# Altium project ESP-12F_WLED_IOT_LIPO.PrjPcb
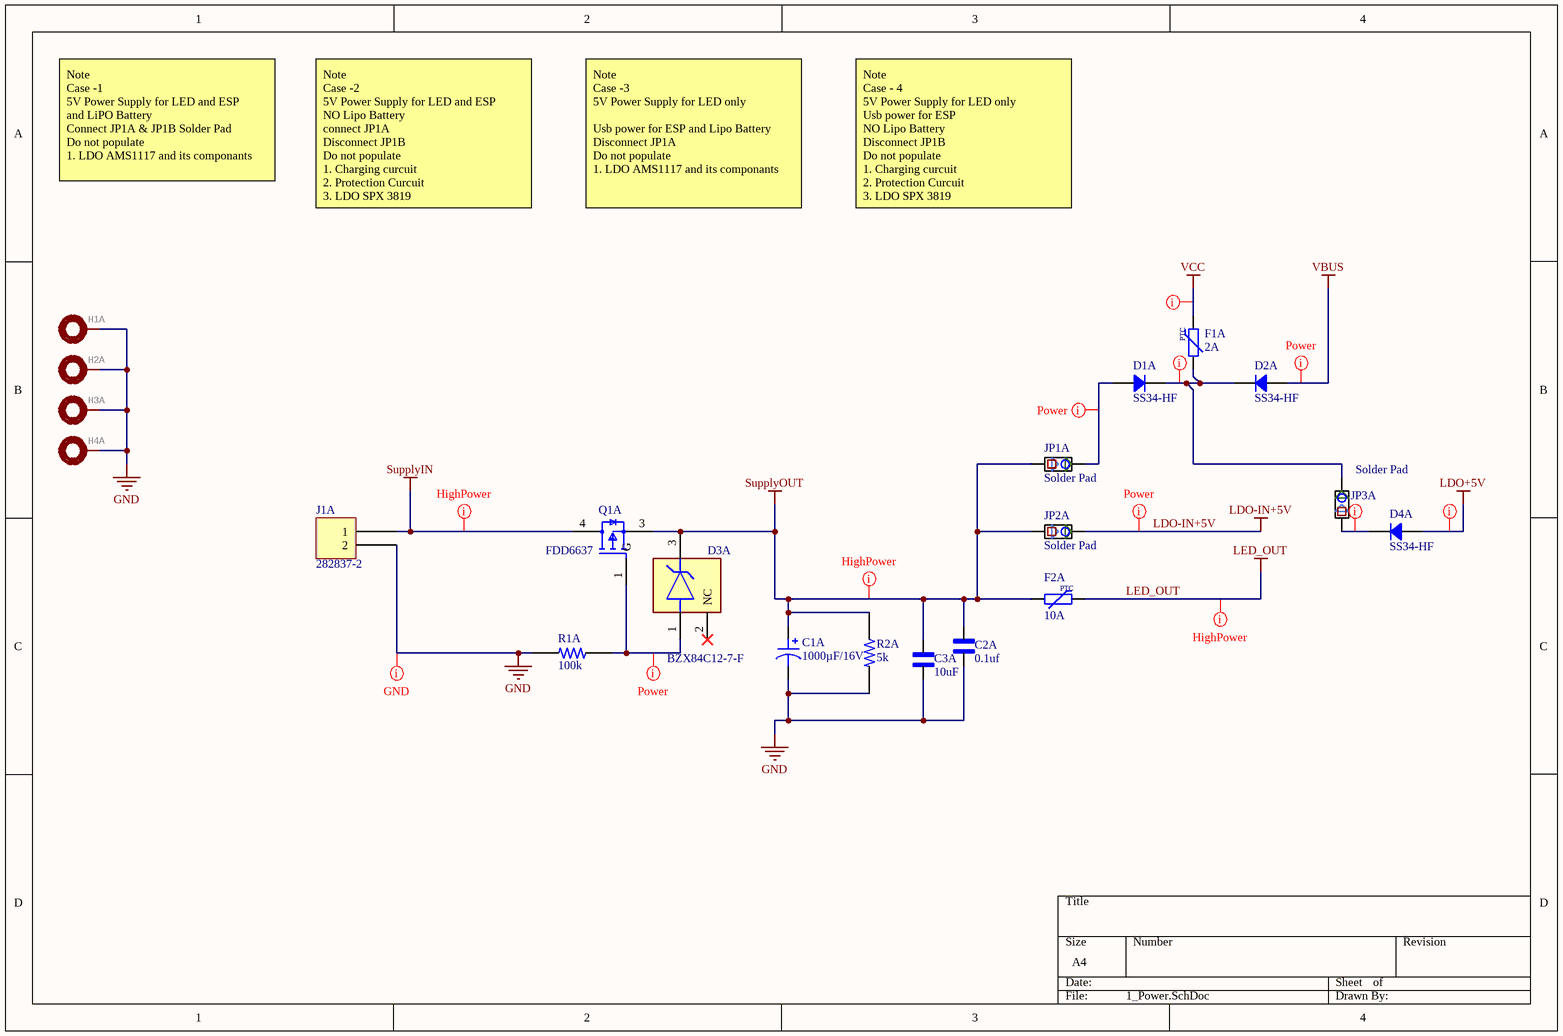
[diagram p0: 1_Power.SchDoc]
12 sheets, 111 parts. Net scope: global (net labels, ports and power ports of the same name join across sheets).
Board file: ESP-12F_WLED_IOT_LIPO_PCB_Version_2.PcbDoc
Sheets:
  0_Overview.SchDoc
  1_Power.SchDoc
  2_LDO+5V.SchDoc
  3_Charging.SchDoc
  4_Protection.SchDoc
  5_BATT+3V3.SchDoc
  6_BATT+5V.SchDoc
  5_USB-UART.SchDoc
  6_ESP12_F.SchDoc
  7_Temp.SchDoc
  8_LevelShifter.SchDoc
  9_Connectors & IO.SchDoc

## Sheet 0_Overview.SchDoc
size A4; SheetNumber: 1; SheetTotal: 5

## Sheet 1_Power.SchDoc
size A4; SheetNumber: 2; SheetTotal: 12; SPICEModelCacheZZLNYIBB: <root> / <DocumentId>ZZLNYIBB</DocumentId> / </root>

### Parts
C1A  1000µF/16V  [CAP TH ALUM ELEC D10.00mm S5.00mm H17.50mm]
C2A  0.1uf  [C-0603]
C3A  10uF  [C-0603]
D1A  SS34-HF  [DO214AC SMA]
D2A  SS34-HF  [DO214AC SMA]
D3A  BZX84C12-7-F  [FP-SOT23-MFG]
D4A  SS34-HF  [DO214AC SMA]
F1A  2A  [FUSE_1206]
F2A  10A  [FUSE_1206]
H1A  MOUNTING PAD, round  [2,4-PAD]  (value not drawn)
H2A  MOUNTING PAD, round  [2,4-PAD]  (value not drawn)
H3A  MOUNTING PAD, round  [2,4-PAD]  (value not drawn)
H4A  MOUNTING PAD, round  [2,4-PAD]  (value not drawn)
J1A  282837-2  [TE 282837-2]
JP1A  Solder Pad  [Solder_Pad_2_Pin_NC_Medium]
JP2A  Solder Pad  [Solder_Pad_2_Pin_NC_Medium]
JP3A  Solder Pad  [Solder_Pad_2_Pin_NC_Medium]
Q1A  FDD6637  [FP-369AS-MFG]
R1A  100k  [R-0603]
R2A  5k  [R-0603]

### Nets
GND: C1A.2 C2A.1 C3A.1 H1A.1(MOUNT) H2A.1(MOUNT) H3A.1(MOUNT) H4A.1(MOUNT) J1A.2 R1A.2 R2A.2
LDO+5V: D4A.1
LDO-IN+5V: JP2A.2
LED_OUT: F2A.2
SupplyIN: J1A.1 Q1A.4(D)
SupplyOUT: C1A.1 C2A.2 C3A.2 D3A.3(C) F2A.1 JP1A.1 JP2A.1 Q1A.3(S) R2A.1
VBUS: D2A.1
VCC: F1A.2
NetD1A_1: D1A.1 JP1A.2
NetD1A_2: D1A.2 D2A.2 F1A.1 JP3A.2
NetD3A_1: D3A.1(A) Q1A.1(G) R1A.1
NetD4A_2: D4A.2 JP3A.1

Not connected (* = marked no-connect by the designer): D3A 2(NC)*

### Layout directives
net class HighPower; rule Supply Nets [Voltage = 0.000]: LED_OUT, SupplyIN, SupplyOUT
net class GND; rule Supply Nets [Voltage = 0.000]: GND
net class Power: NetD1A_1
net class Power; rule Supply Nets [Voltage = 0.000]: LDO+5V, LDO-IN+5V, NetD1A_2, NetD3A_1, NetD4A_2, VBUS, VCC

### Notes on the sheet
- Note
  Case -1
  5V Power Supply for LED and ESP
  and LiPO Battery
  Connect JP1A & JP1B Solder Pad
  Do not populate
  1. LDO AMS1117 and its componants
- Note
  Case -2
  5V Power Supply for LED and ESP
  NO Lipo Battery
  connect JP1A
  Disconnect JP1B
  Do not populate
  1. Charging curcuit
  2. Protection Curcuit
  3. LDO SPX 3819
- Note
  Case -3
  5V Power Supply for LED only
  Usb power for ESP and Lipo Battery
  Disconnect JP1A
  Do not populate
  1. LDO AMS1117 and its componants
- Note
  Case - 4
  5V Power Supply for LED only
  Usb power for ESP
  NO Lipo Battery
  Disconnect JP1B
  Do not populate
  1. Charging curcuit
  2. Protection Curcuit
  3. LDO SPX 3819
- (in symbol FUSE_PPTC_1206) PTC

### Library data of the parts
C1A = EEU-FK1C102: AL LYTIC, RADIAL, 16VDC, 1000UF; manufacturer: Panasonic Electronic Components; Capacitance: 1000µF; Impedance: 49 mOhms; Lifetime @ Temp.: 4000 Hrs @ 105°C; Polarization: Polar; Ripple Current @ High Frequency: 1.24A @ 100kHz; Ripple Current @ Low Frequency: 930mA @ 120Hz; Tolerance: ±20%; Voltage - Rated: 16V; Part Number: EEU-FK1C102; Applications: Automotive; componentlink1description: Datasheet; componentlink1url: https://industrial.panasonic.com/cdbs/www-data/pdf/RDF0000/ABA0000C1015.pdf; componentlink2description: DigiKey Link; componentlink2url: http://digikey.com/product-detail/en/panasonic-electronic-components/EEU-FK1C102/P124274-ND/9921223; Device Package: Radial, Can; Height - Seated (Max): 0.689" (17.50mm); lastupdated: 02-09-2020 01:31:24 AM; Lead Spacing: 0.197" (5.00mm); Lifecycle Status: Active; Minimum Order: 1; Mounting Type: Through Hole; Operating Temperature: -55°C ~ 105°C; Package / Case: Radial, Can; packaging: Bulk; partid: 11906; Part Status: Active; price: 0.83; Ratings: AEC-Q200; series: FK; Size / Dimension: 0.394" Dia (10.00mm); Supplier 1: DigiKey; Supplier Part Number 1: P124274-ND; value: 1000µF/16V
C2A C3A = C-0603: Ceramic Capacitor 16V 0603 (1608 Metric); MP: C0603C104J4RAC; MF: KEMET; SnapEDA_Link: https://www.snapeda.com/parts/C0603C104J4RAC/KEMET/view-part/1763758/?ref=snap; Availability: Warning; Package: 0603 KEMET; Check_prices: https://www.snapeda.com/parts/C0603C104J4RAC/KEMET/view-part/1763758/?ref=eda; Value: *; Price: None
D1A D2A D4A = SS34-HF: DIODE SCHOTTKY 40V 3A DO214AC; Manufacturer: Comchip Technology; Capacitance @ Vr, F: 450pF @ 4V, 1MHz; Current - Reverse Leakage @ Vr: 500 µA @ 40 V; Speed: Fast Recovery =< 500ns, > 200mA (Io); Voltage - Forward (Vf) (Max) @ If: 550 mV @ 3 A; Part Number: SS34-HF; ComponentLink1Description: Datasheet; ComponentLink1URL: http://www.comchiptech.com/admin/files/product/20190514101641.pdf; ComponentLink2Description: DigiKey Link; ComponentLink2URL: https://www.digikey.com/en/products/detail/comchip-technology/SS34-HF/10279693; Current - Average Rectified (Io): 3A; Diode Type: Schottky; LastUpdated: 30-12-2022 08:53:12 PM; Lifecycle Status: Active; Minimum Order: 1; Mounting Type: Surface Mount; Operating Temperature - Junction: -55°C ~ 125°C; Package / Case: DO-214AC, SMA; Packaging: TapeAndReel; PartId: 2138; Part Status: Active; Price: 0.07; Series: -; Supplier 1: DigiKey; Supplier Part Number 1: 641-2115-1-ND; Supplier Device Package: DO-214AC (SMA); Voltage - DC Reverse (Vr) (Max): 40 V
D3A = CMP-12792-000017-1: DIODE ZENER 12V 300MW SOT23-3; Manufacturer: Diodes Inc.; Max Reverse Leakage Current: 0.1uA; Max Zener Voltage: 12.7V; Reverse Voltage: 8V; Zener Impedance: 25Ω; Max Junction Temp: +150°C; Standoff Height: 0.013mm; Height: 1.1mm; RoHS: TRUE; Manufacturer Part Number: BZX84C12-7-F; Digikey Description: DIODE ZENER 12V 300MW SOT23-3; Device Class L2: Diodes; Power Dissipation: 300mW; Category: Diode; Device Class L3: Zener Diodes; Footprint Url: https://www.diodes.com/assets/Package-Files/SOT23.pdf; Nom Zener Voltage: 12V; Temperature: -65°C to +150°C; ComponentLink2Description: Datasheet; Lead Free: Yes; ComponentLink2URL: https://www.diodes.com/assets/Datasheets/ds18001.pdf; Mouser Description: Zener Diodes 12V 350mW; Temperature Range Low: -65°C; Automotive: No; Package: SOT23; Ipc Land Pattern Name: SOT92P240X102-3; Temperature Range High: +150°C; Octopart: https://octopart.com/bzx84c12-7-f-diodes+inc.-327696; Device Class L1: Discrete Semiconductors
F1A F2A = FUSE_PPTC_1206: Fuse PPTC SMD 1206; Manufacturer: *; Manufacturer Part Number: *
H1A H2A H3A H4A = MOUNT-PAD-ROUND2.4: GateName_1: G$1; DeviceName: 2.8; POPULARITY: 6; SymbolName_1: MOUNT-PAD; LibraryName: Holes-Custom; DeviceSetName: MOUNT-PAD-ROUND; Package: 2,8-PAD
J1A = 282837-2: TERM BLK 2P SIDE ENT 5.08MM PCB; Manufacturer: TE Connectivity AMP Connectors; Pitch: 0.200" (5.08mm); Current: 13.5 A; Mating Orientation: Horizontal with Board; Number of Levels: 1; Positions Per Level: 2; Voltage: 300 V; Wire Gauge: 16-28 AWG; Wire Termination: Screw - Rising Cage Clamp; Packaging: Tray; Part Number: 282837-2; Color: Green; ComponentLink1Description: Datasheet; ComponentLink1URL: https://www.te.com/commerce/DocumentDelivery/DDEController?Action=srchrtrv&DocNm=282837&DocType=Customer+Drawing&DocLang=English; ComponentLink2Description: DigiKey Link; ComponentLink2URL: https://www.digikey.com/en/products/detail/te-connectivity-amp-connectors/282837-2/2187973; Features: Interlocking (Side); LastUpdated: 21-06-2022 03:00:23 PM; Lifecycle Status: Active; Minimum Order: 1; Mounting Type: Through Hole; Part Status: Active; Price: 0.31; Series: Buchanan; Supplier 1: DigiKey; Supplier Part Number 1: A113320-ND
JP1A JP2A JP3A = Solder_Pad_2_Pin_NC_Medium: Solder Pad 2 Pin NC 1.016 mm Pitch
Q1A = CMP-07173-000090-1: MOSFET P-CH 35V 13A DPAK; Manufacturer: ON Semiconductor; Threshold Vgs Max: -3V; Transconductance: 35S; Rthja Max: 96°C/W; Pulse Drain Current: -100A; Reverse Recovery Time: 28ns; Number Of P Channels: 1; Drain To Source Voltage: -35V; Turn On Delay Time: 18ns; Depletion Mode: False; Turn Off Delay Time: 62ns; Max Junction Temp: +150°C; Gate To Source Voltage: 25V; Gate Charge At Vgs: 45nC @ -10V; Threshold Vgs Min: -1V; Drain To Source Resistance: 9.7mΩ; Power Dissipation: 1.3W; Typ Forward Diode Voltage: -0.8V; Input Capacitace At Vds: 2370pF @ -20V; Max Forward Diode Voltage: -1.2V; Continuous Drain Current: -13A; Reverse Recovery Charge: 15nC; Temperature: -55°C to +150°C; Package: 369AS; Device Class L2: Transistors; Automotive: No; ComponentLink2URL: https://www.onsemi.com/pub/Collateral/FDD6637-D.pdf; Temperature Range Low: -55°C; Manufacturer Part Number: FDD6637; Number Of Channels: 1; Lead Free: Yes; Temperature Range High: +150°C; ComponentLink2Description: Datasheet; RoHS: TRUE; Octopart: https://octopart.com/fdd6637-on+semiconductor-84325825; Drain To Source Breakdown Voltage: -35V; Footprint Url: https://www.onsemi.com/pub/Collateral/369AS.PDF; Category: Trans; Device Class L1: Discrete Semiconductors; Digikey Description: MOSFET P-CH 35V 13A DPAK; Device Class L3: MOSFETs; Mouser Description: MOSFET 35V PCH PowerTrench MOSFET; Height: 2.517mm
R1A R2A = R-0603: 0603; MP: 2-1623703-0; Power_Rating: .1 W; Value: 10K; Tolerance: 1%; MF: TE Connectivity; Package: 0603; Price: None; Resistance: 10K; Check_prices: https://www.snapeda.com/parts/2-1623703-0/TE%20Connectivity/view-part/2213192/?ref=eda; SnapEDA_Link: https://www.snapeda.com/parts/2-1623703-0/TE%20Connectivity/view-part/2213192/?ref=snap; Availability: Warning

## Sheet 2_LDO+5V.SchDoc
size A4; SheetNumber: 3; SheetTotal: 12
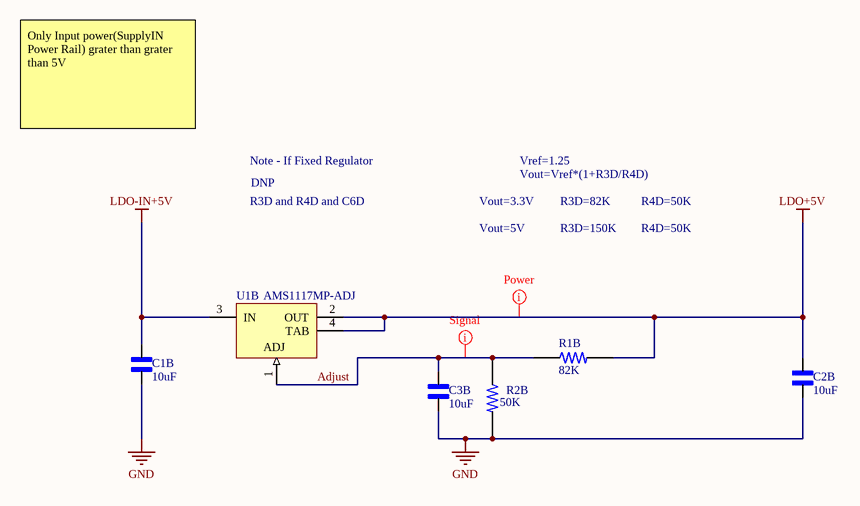
[diagram p1: 2_LDO+5V.SchDoc]

### Parts
C1B  10uF  [C-0603]
C2B  10uF  [C-0603]
C3B  10uF  [C-0603]
R1B  82K  [R-0603]
R2B  50K  [R-0603]
U1B  AMS1117MP-ADJ  [MP04A_N]

### Nets
GND: C1B.1 C2B.1 C3B.1 R2B.2
LDO+5V: C2B.2 R1B.2 U1B.2(OUT) U1B.4(TAB)
LDO-IN+5V: C1B.2 U1B.3(IN)
Adjust: C3B.2 R1B.1 R2B.1 U1B.1(ADJ)

### Layout directives
net class Power: LDO+5V
net class Signal: Adjust

### Notes on the sheet
- Only Input power(SupplyIN Power Rail) grater than grater than 5V
- Note - If Fixed Regulator
- DNP
- Vout=Vref*(1+R3D/R4D)
- Vref=1.25
- R3D and R4D and C6D
- Vout=3.3V
- Vout=5V
- R3D=82K
- R3D=150K
- R4D=50K

### Library data of the parts
C1B C2B C3B = C-0603: as C2A on sheet 1_Power; SnapEDA_Link: https://www.snapeda.com/parts/C0603C104J4RAC/KEMET/view-part/1763758/?ref=snap; Availability: Warning; Package: 0603 KEMET; Check_prices: https://www.snapeda.com/parts/C0603C104J4RAC/KEMET/view-part/1763758/?ref=eda; Price: None
  C1B C2B: Value: *
  C3B: Value: 10uF
R1B R2B = R-0603: as R1A on sheet 1_Power; Package: 0603; Price: None; Resistance: 10K; Check_prices: https://www.snapeda.com/parts/2-1623703-0/TE%20Connectivity/view-part/2213192/?ref=eda; SnapEDA_Link: https://www.snapeda.com/parts/2-1623703-0/TE%20Connectivity/view-part/2213192/?ref=snap; Availability: Warning
U1B = CMP-0062-01645-3: 800mA Low-Dropout Linear Regulator, 4-pin SOT-223; PartNumber: LM1117MP-ADJ; Manufacturer: National Semiconductor; High-Reliability: Y; PackageTopMarking: XYTT*N03A; CompType: LDO IC; PowerWise: N; ComponentLink2URL: http://www.national.com/ds/LM/LM1117.pdf; ComponentLink1Description: Manufacturer URL; DatasheetVersion: Apr-2006; PackageReference: MP04A; RoHS: N; ComponentLink3Description: LM1117 Web Page; RevisionNote: SCH symbol layout adjusted; PackageDescription: Molded SOT-223, 6.50 x 3.56 x 1.6mm Body, 4 Lead, 2.3mm Pitch; Code_IPC: SOT223-4; ComponentLink1URL: http://www.national.com/; ComponentLink4Description: MP04A Package Page; ComponentLink3URL: http://www.national.com/pf/LM/LM1117.html; PackageVersion: revB, Apr-2003; ComponentLink2Description: LM1117 Datasheet; PinCount: 4; ComponentLink4URL: http://www.national.com/packaging/folders/mp04a.html; Code_JEDEC: TO-261-AA

## Sheet 3_Charging.SchDoc
size A4; SheetNumber: 4; SheetTotal: 12
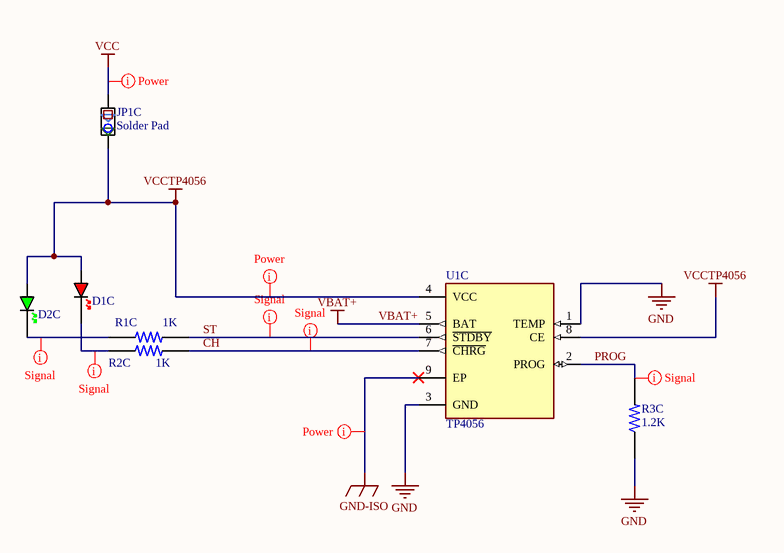
[diagram p2: 3_Charging.SchDoc]

### Parts
D1C  RED  [LED_0603_RED]  (value not drawn)
D2C  GREEN  [LED_0603_GREEN]  (value not drawn)
JP1C  Solder Pad  [Solder_Pad_2_Pin_NC_Medium]
R1C  1K  [R-0603]
R2C  1K  [R-0603]
R3C  1.2K  [R-0603]
U1C  TP4056  [TP4056]

### Nets
GND: R3C.1 U1C.1(TEMP) U1C.3(GND)
GND-ISO: U1C.9(EP)
VBAT+: U1C.5(BAT)
VCC: JP1C.1
VCCTP4056: D1C.A D2C.A JP1C.2 U1C.4(VCC) U1C.8(CE)
CH: R2C.2 U1C.7(~{CHRG})
PROG: R3C.2 U1C.2(PROG)
ST: R1C.2 U1C.6(~{STDBY})
NetD1C_K: D1C.K R2C.1
NetD2C_K: D2C.K R1C.1

### Layout directives
net class Power; rule Supply Nets [Voltage = 0.000]: GND-ISO, VCCTP4056
net class Signal: CH, NetD1C_K, NetD2C_K, PROG, ST
net class Power: VCC

### Library data of the parts
D1C = LED_0603_RED: LED 0603 RED SMD
D2C = LED_0603_GREEN: LED 0603 GREEN SMD
JP1C = Solder_Pad_2_Pin_NC_Medium: Solder Pad 2 Pin NC 1.016 mm Pitch
R1C R2C R3C = R-0603: as R1A on sheet 1_Power; Package: 0603; Price: None; Resistance: 10K; Check_prices: https://www.snapeda.com/parts/2-1623703-0/TE%20Connectivity/view-part/2213192/?ref=eda; SnapEDA_Link: https://www.snapeda.com/parts/2-1623703-0/TE%20Connectivity/view-part/2213192/?ref=snap; Availability: Warning
U1C = TP4056: Complete single cell Li-Ion battery with a constant current / constant voltage linear charger; Package: None; MP: TP4056; Value: *; Price: None; Availability: Unavailable

## Sheet 4_Protection.SchDoc
size A4; SheetNumber: 5; SheetTotal: 12
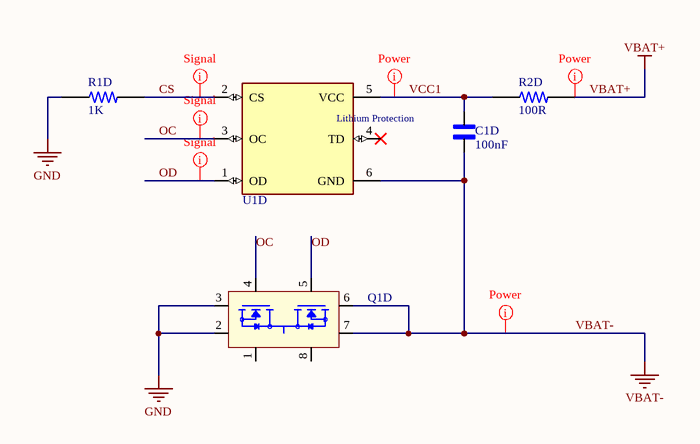
[diagram p3: 4_Protection.SchDoc]

### Parts
C1D  100nF  [C-0603]
Q1D  !value  [FS8205A TSSOP-8]  (value not drawn)
R1D  1K  [R-0603]
R2D  100R  [R-0603]
U1D  DW01A  [SOT23-6]  (value not drawn)

### Nets
GND: Q1D.2(S1) Q1D.3(S1) R1D.1
VBAT+: R2D.2
VBAT-: C1D.1 Q1D.6(S2) Q1D.7(S2) U1D.6(GND)
CS: R1D.2 U1D.2(CS)
OC: Q1D.4(G1) U1D.3(OC)
OD: Q1D.5(G2) U1D.1(OD)
VCC1: C1D.2 R2D.1 U1D.5(VCC)

Not connected (* = marked no-connect by the designer): Q1D 1(D12) 8(D12); U1D 4(TD)*

### Layout directives
net class Power; rule Supply Nets [Voltage = 0.000]: VBAT+, VBAT-, VCC1
net class Signal: CS, OC, OD

### Notes on the sheet
- (in symbol DW01A) Lithium Protection

### Library data of the parts
C1D = C-0603: as C2A on sheet 1_Power; SnapEDA_Link: https://www.snapeda.com/parts/C0603C104J4RAC/KEMET/view-part/1763758/?ref=snap; Availability: Warning; Package: 0603 KEMET; Check_prices: https://www.snapeda.com/parts/C0603C104J4RAC/KEMET/view-part/1763758/?ref=eda; Value: *; Price: None
Q1D = FS8205A_2.0: Dual N-Channel Mosfet, Eq 8205A CEG8205A FS8205A STN8205A; Availability: Unavailable; Package: None; Price: None; Value: FS8205A; MP: FS8205A
R1D R2D = R-0603: as R1A on sheet 1_Power; Package: 0603; Price: None; Resistance: 10K; Check_prices: https://www.snapeda.com/parts/2-1623703-0/TE%20Connectivity/view-part/2213192/?ref=eda; SnapEDA_Link: https://www.snapeda.com/parts/2-1623703-0/TE%20Connectivity/view-part/2213192/?ref=snap; Availability: Warning
U1D = DW01A: Pushbutton Switch SPST-NC Standard Panel Mount, Front; MF: Fortune Semiconductor; Price: None; Availability: Unavailable; Package: Package Analog Devices; SnapEDA_Link: https://www.snapeda.com/parts/DW01A/Fortune%20Semiconductor/view-part/4388554/?ref=snap; MP: DW01A; Value: *

## Sheet 5_BATT+3V3.SchDoc
size A4; SheetNumber: 6; SheetTotal: 12
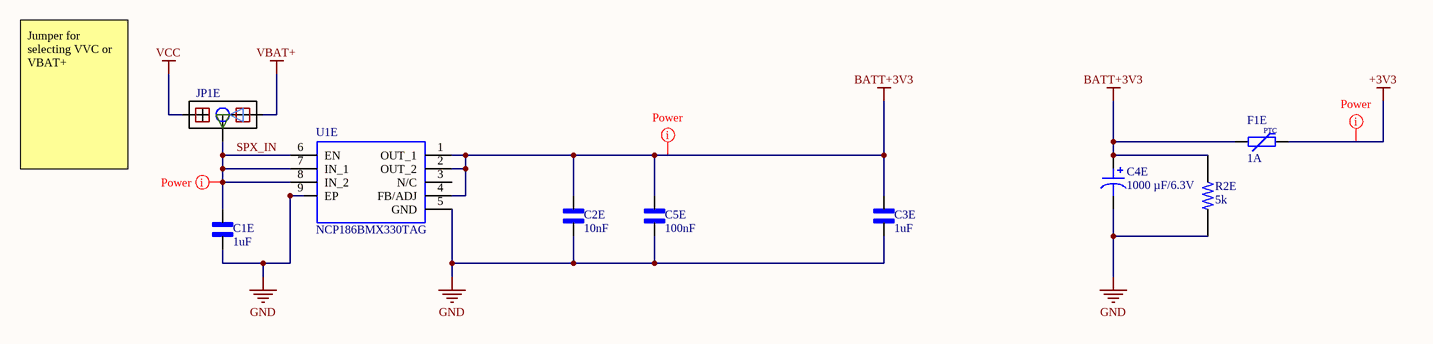
[diagram p4: 5_BATT+3V3.SchDoc]

### Parts
C1E  1uF  [C-0603]
C2E  10nF  [C-0603]
C3E  1uF  [C-0603]
C4E  1000 µF/6.3V  [CAP AL TH D8 L3.5 H12.5]
C5E  100nF  [C-0603]
F1E  1A  [FUSE_1206]
JP1E  Solder Pad  [Solder_Pad_3_Pin_NC_Medium]  (value not drawn)
R2E  5k  [R-0603]
U1E  NCP186BMX330TAG  [NCP186AMX330TAG]

### Nets
+3V3: F1E.2
BATT+3V3: C2E.2 C3E.2 C4E.1 C5E.2 F1E.1 R2E.1 U1E.1(OUT_1) U1E.2(OUT_2) U1E.4(FB/ADJ)
GND: C1E.1 C2E.1 C3E.1 C4E.2 C5E.1 R2E.2 U1E.5(GND) U1E.9(EP)
VBAT+: JP1E.1
VCC: JP1E.3
SPX_IN: C1E.2 JP1E.2 U1E.6(EN) U1E.7(IN_1) U1E.8(IN_2)

Not connected (* = marked no-connect by the designer): U1E 3(N/C)

### Layout directives
net class Power; rule Supply Nets [Voltage = 0.000]: +3V3, BATT+3V3, SPX_IN

### Notes on the sheet
- Jumper for selecting VVC or VBAT+
- (in symbol FUSE_PPTC_1206) PTC

### Library data of the parts
C1E C2E C3E C5E = C-0603: as C2A on sheet 1_Power; SnapEDA_Link: https://www.snapeda.com/parts/C0603C104J4RAC/KEMET/view-part/1763758/?ref=snap; Availability: Warning; Package: 0603 KEMET; Check_prices: https://www.snapeda.com/parts/C0603C104J4RAC/KEMET/view-part/1763758/?ref=eda; Value: *; Price: None
C4E = ECA-0JHG102: CAP ALUM 1000UF 20% 6.3V RADIAL; manufacturer: Panasonic Electronic Components; Capacitance: 1000 µF; Lifetime @ Temp.: 1000 Hrs @ 105°C; Polarization: Polar; Ripple Current @ High Frequency: 437 mA @ 100 kHz; Ripple Current @ Low Frequency: 380 mA @ 120 Hz; Part Number: ECA-0JHG102; Applications: General Purpose; componentlink1description: Datasheet; componentlink1url: https://industrial.panasonic.com/cdbs/www-data/pdf/RDF0000/ABA0000C75.pdf; componentlink2description: DigiKey Link; componentlink2url: https://www.digikey.com/en/products/detail/panasonic-electronic-components/ECA-0JHG102/245108; Device Package: Radial, Can; Height - Seated (Max): 0.492" (12.50mm); lastupdated: 27-12-2022 10:20:14 PM; Lead Spacing: 0.138" (3.50mm); Lifecycle Status: Active; Minimum Order: 1; Mounting Type: Through Hole; Operating Temperature: -55°C ~ 105°C; Package / Case: Radial, Can; packaging: Bulk; partid: 7190; Part Status: Active; price: 0.15; series: NHG-A; Size / Dimension: 0.315" Dia (8.00mm); Supplier 1: DigiKey; Supplier Part Number 1: P5509-ND; Tolerance: ±20%; value: 1000 µF/6.3V; Voltage - Rated: 6.3 V
F1E = FUSE_PPTC_1206: Fuse PPTC SMD 1206; Manufacturer: *; Manufacturer Part Number: *
JP1E = Solder_Pad_3_Pin_NC_Medium: Solder Pad 3 Pin NC 1.016 mm Pitch
R2E = R-0603: as R1A on sheet 1_Power; Package: 0603; Price: None; Resistance: 10K; Check_prices: https://www.snapeda.com/parts/2-1623703-0/TE%20Connectivity/view-part/2213192/?ref=eda; SnapEDA_Link: https://www.snapeda.com/parts/2-1623703-0/TE%20Connectivity/view-part/2213192/?ref=snap; Availability: Warning
U1E = NCP186BMX330TAG: LDO Voltage Regulators FAST TRANSIENT RESPO; Manufacturer_Name: onsemi; Mouser Part Number: 863-NCP186BMX330TAG; Mouser Price/Stock: https://www.mouser.co.uk/ProductDetail/onsemi/NCP186BMX330TAG?qs=tCMd4XlZ%2FiDuLBXmI4EY0w%3D%3D; Manufacturer_Part_Number: NCP186BMX330TAG; Datasheet Link: http://www.onsemi.com/pub/Collateral/NCP186-D.PDF

## Sheet 6_BATT+5V.SchDoc
size A4; SheetNumber: 7; SheetTotal: 12
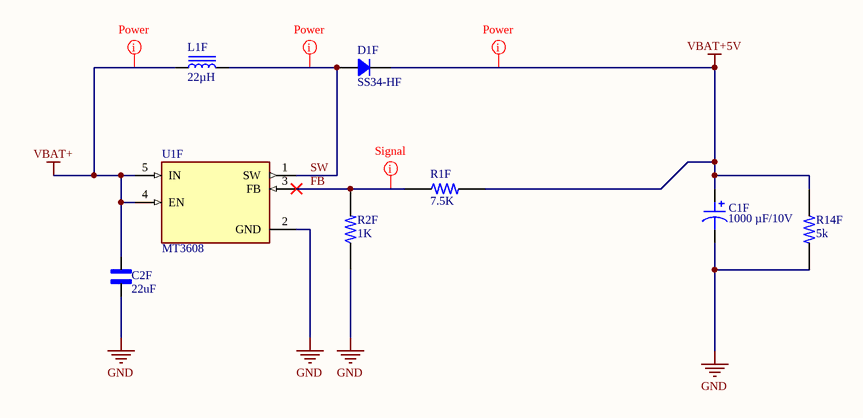
[diagram p5: 6_BATT+5V.SchDoc]

### Parts
C1F  1000 µF/10V  [CAP AL TH D8 L3.5 H12.5]
C2F  22uF  [C-0603]
D1F  SS34-HF  [DO214AC SMA]
L1F  22µH  [TDK SLF7032]
R1F  7.5K  [R-0603]
R2F  1K  [R-0603]
R14F  5k  [R-0603]
U1F  MT3608  [MT3608-SOT23]

### Nets
GND: C1F.2 C2F.1 R2F.1 R14F.2 U1F.2(GND)
VBAT+: C2F.2 L1F.1 U1F.4(EN) U1F.5(IN)
VBAT+5V: C1F.1 D1F.2 R1F.2 R14F.1
FB: R1F.1 R2F.2 U1F.3(FB)
SW: D1F.1 L1F.2 U1F.1(SW)

### Layout directives
net class Power: VBAT+
net class Power; rule Supply Nets [Voltage = 0.000]: SW, VBAT+5V
net class Signal: FB

### Library data of the parts
C1F = ECA-0JHG102: as C4E on sheet 5_BATT+3V3; Part Number: ECA-0JHG102; Applications: General Purpose; componentlink1description: Datasheet; componentlink1url: https://industrial.panasonic.com/cdbs/www-data/pdf/RDF0000/ABA0000C75.pdf; componentlink2description: DigiKey Link; componentlink2url: https://www.digikey.com/en/products/detail/panasonic-electronic-components/ECA-0JHG102/245108; Device Package: Radial, Can; Height - Seated (Max): 0.492" (12.50mm); lastupdated: 27-12-2022 10:20:14 PM; Lead Spacing: 0.138" (3.50mm); Lifecycle Status: Active; Minimum Order: 1; Mounting Type: Through Hole; Operating Temperature: -55°C ~ 105°C; Package / Case: Radial, Can; packaging: Bulk; partid: 7190; Part Status: Active; price: 0.15; series: NHG-A; Size / Dimension: 0.315" Dia (8.00mm); Supplier 1: DigiKey; Supplier Part Number 1: P5509-ND; Tolerance: ±20%; value: 1000 µF/10V; Voltage - Rated: 6.3 V
C2F = C-0603: as C2A on sheet 1_Power; SnapEDA_Link: https://www.snapeda.com/parts/C0603C104J4RAC/KEMET/view-part/1763758/?ref=snap; Availability: Warning; Package: 0603 KEMET; Check_prices: https://www.snapeda.com/parts/C0603C104J4RAC/KEMET/view-part/1763758/?ref=eda; Value: *; Price: None
D1F = SS34-HF: as D1A on sheet 1_Power; Part Number: SS34-HF; ComponentLink2Description: DigiKey Link; ComponentLink2URL: https://www.digikey.com/en/products/detail/comchip-technology/SS34-HF/10279693; Current - Average Rectified (Io): 3A; Diode Type: Schottky; LastUpdated: 01-01-2023 08:55:34 PM; Lifecycle Status: Active; Minimum Order: 1; Mounting Type: Surface Mount; Package / Case: DO-214AC, SMA; Packaging: TapeAndReel; PartId: 2138; Price: 0.07; Supplier 1: DigiKey; Supplier Part Number 1: 641-2115-1-ND; Supplier Device Package: DO-214AC (SMA); Voltage - DC Reverse (Vr) (Max): 40 V; ComponentLink1Description: Datasheet; ComponentLink1URL: http://www.comchiptech.com/admin/files/product/20190514101641.pdf; Operating Temperature - Junction: -55°C ~ 125°C; Part Status: Active; Series: -
L1F = SLF7032T-220MR96-2PF: FIXED IND 22UH 960MA 132 MOHM; Manufacturer: TDK Corporation; DC Resistance (DCR): 132mOhm Max; Inductance Frequency - Test: 100kHz; Material - Core: Ferrite; Shielding: Shielded; Tolerance: ±20%; Type: Wirewound; Part Number: SLF7032T-220MR96-2PF; ComponentLink1Description: Datasheet; ComponentLink1URL: //media.digikey.com/pdf/Data%20Sheets/TDK%20PDFs/SLF7032_Type.pdf; ComponentLink2Description: DigiKey Link; ComponentLink2URL: http://digikey.com/product-detail/en/tdk-corporation/SLF7032T-220MR96-2PF/445-2003-1-ND/755410; Current Rating (Amps): 960mA; Device Package: Nonstandard; Height - Seated (Max): 0.134" (3.40mm); Inductance: 22µH; LastUpdated: 02-09-2020 01:30:24; Lifecycle Status: Active; Minimum Order: 1; Mounting Type: Surface Mount; Operating Temperature: -40°C ~ 105°C; Package / Case: Nonstandard; Packaging: TapeAndReel; PartId: 3680; Part Status: Active; Price: 0.43; Series: SLF; Size / Dimension: 0.276" L x 0.276" W (7.00mm x 7.00mm); Supplier 1: DigiKey; Supplier Part Number 1: 445-2003-1-ND; Value: 22µH
R1F R2F R14F = R-0603: as R1A on sheet 1_Power; Package: 0603; Price: None; Resistance: 10K; Check_prices: https://www.snapeda.com/parts/2-1623703-0/TE%20Connectivity/view-part/2213192/?ref=eda; SnapEDA_Link: https://www.snapeda.com/parts/2-1623703-0/TE%20Connectivity/view-part/2213192/?ref=snap; Availability: Warning
U1F = MT3608: High Efficiency 1.2MHz 2A Step Up Converter; Value: *; Availability: Unavailable; Price: None; Package: None; MP: MT3608

## Sheet 5_USB-UART.SchDoc
size A4; SheetNumber: 8; SheetTotal: 12
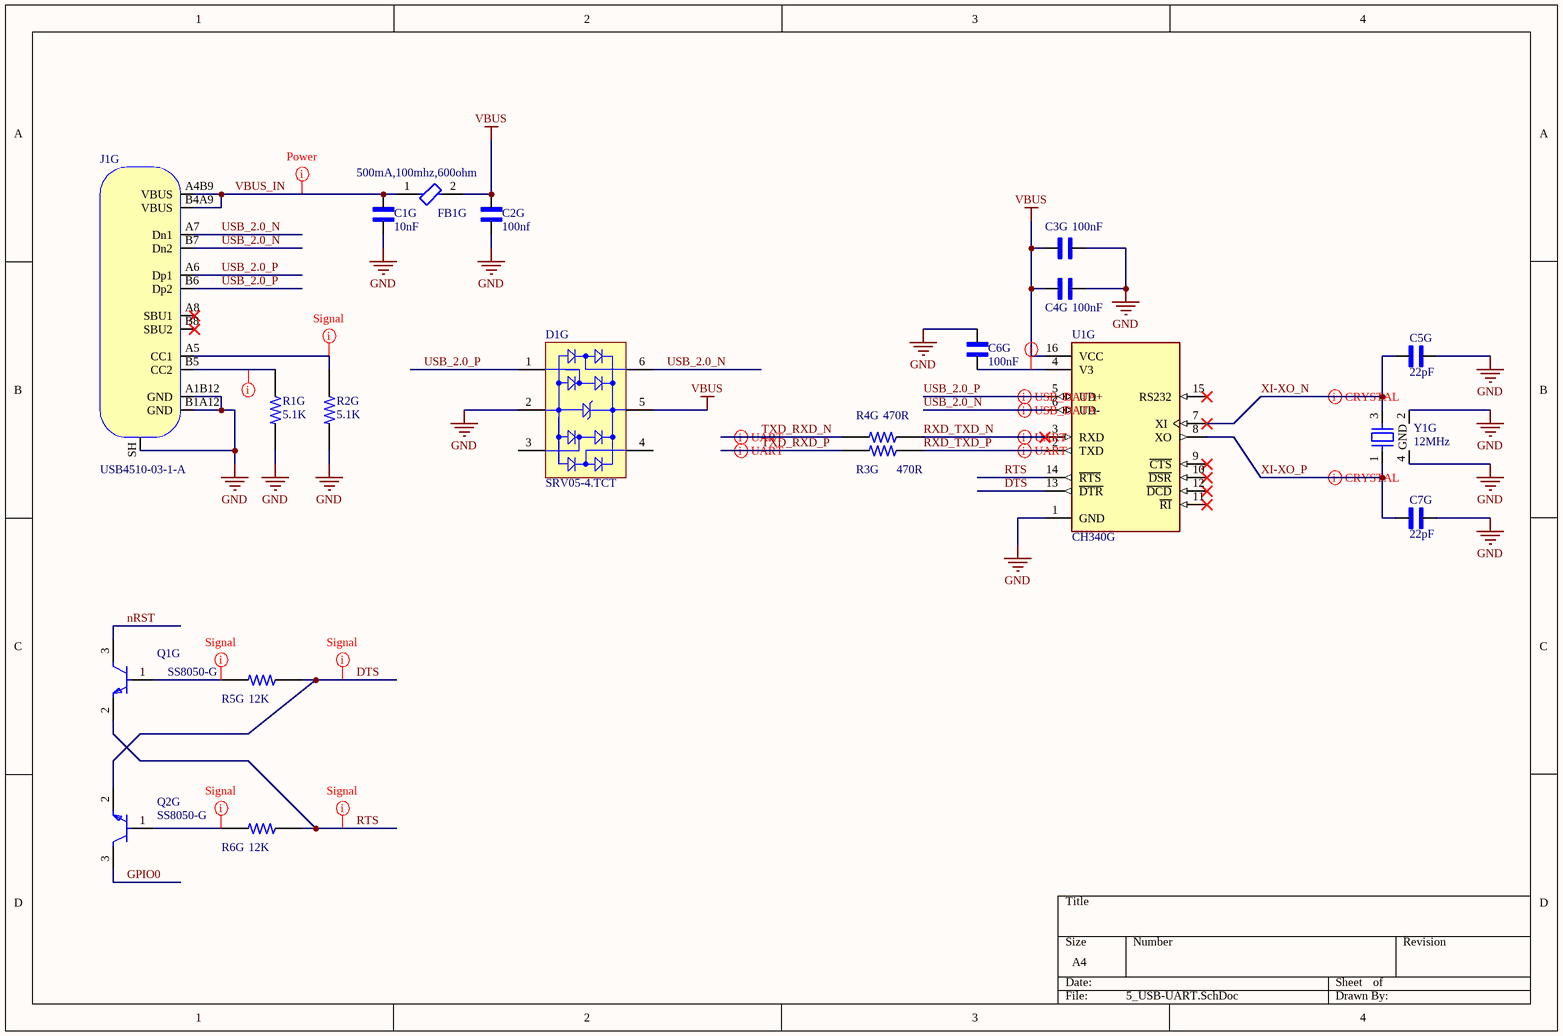
[diagram p6: 5_USB-UART.SchDoc]

### Parts
C1G  10nF  [C-0603]
C2G  100nf  [C-0603]
C3G  100nF  [C-0603]
C4G  100nF  [C-0603]
C5G  22pF  [C-0603]
C6G  100nF  [C-0603]
C7G  22pF  [C-0603]
D1G  SRV05-4.TCT  [SMTC-SOT23-6_V]
FB1G  500mA,100mhz,600ohm  [FP-BLM21-0_2-t0_85-e0_5-IPC_A]
J1G  USB4510-03-1-A  [USB4510-03-1-A]
Q1G  SS8050-G  [FP-SS8050-G-MFG]
Q2G  SS8050-G  [FP-SS8050-G-MFG]
R1G  5.1K  [R-0603]
R2G  5.1K  [R-0603]
R3G  470R  [R-0603]
R4G  470R  [R-0603]
R5G  12K  [R-0603]
R6G  12K  [R-0603]
U1G  CH340G  [SOIC127P600X180-16N]
Y1G  12MHz  [ABRACON ABM10]

### Nets
GND: C1G.1 C2G.1 C3G.1 C4G.1 C5G.2 C6G.1 C7G.2 D1G.2(GND) J1G.A1B12(GND) J1G.B1A12(GND) J1G.SH(SHIELD) R1G.2 R2G.2 U1G.1(GND) Y1G.2(GND) Y1G.4(GND)
VBUS: C2G.2 C3G.2 C4G.2 D1G.5(VBUS) FB1G.2 U1G.16(VCC)
DTS: Q2G.2(E) R5G.1 U1G.13(~{DTR})
GPIO0: Q2G.3(C)
nRST: Q1G.3(C)
RTS: Q1G.2(E) R6G.1 U1G.14(~{RTS})
RXD_TXD_N: R3G.1 U1G.3(RXD)
RXD_TXD_P: R4G.1 U1G.2(TXD)
TXD_RXD_N: R3G.2
TXD_RXD_P: R4G.2
USB_2.0_N: D1G.6(I/O_4) J1G.A7(Dn1) J1G.B7(Dn2) U1G.6(UD-)
USB_2.0_P: D1G.1(I/O_1) J1G.A6(Dp1) J1G.B6(Dp2) U1G.5(UD+)
VBUS_IN: C1G.2 FB1G.1 J1G.A4B9(VBUS) J1G.B4A9(VBUS)
XI-XO_N: C5G.1 U1G.7(XI) Y1G.3
XI-XO_P: C7G.1 U1G.8(XO) Y1G.1
NetC6G_2: C6G.2 U1G.4(V3)
NetJ1G_A5: J1G.A5(CC1) R2G.1
NetJ1G_B5: J1G.B5(CC2) R1G.1
NetQ1G_1: Q1G.1(B) R5G.2
NetQ2G_1: Q2G.1(B) R6G.2

Not connected (* = marked no-connect by the designer): D1G 3(I/O_2) 4(I/O_3); J1G A8(SBU1)* B8(SBU2)*; U1G 9(~{CTS})* 10(~{DSR})* 11(~{RI})* 12(~{DCD})* 15(RS232)*

### Layout directives
differential pair; differential pair class DIFF_PAIR; net class CRYSTAL: XI-XO_N, XI-XO_P
differential pair; differential pair class DIFF_PAIR; net class UART: RXD_TXD_N, RXD_TXD_P, TXD_RXD_N, TXD_RXD_P
differential pair; differential pair class DIFF_PAIR; net class USB_DATA: USB_2.0_N, USB_2.0_P
net class Power; rule Supply Nets [Voltage = 0.000]: VBUS_IN
net class Signal: DTS, NetC6G_2, NetJ1G_A5, NetJ1G_B5, NetQ1G_1, NetQ2G_1, RTS

### Library data of the parts
C1G C2G C3G C4G C5G C6G C7G = C-0603: as C2A on sheet 1_Power; SnapEDA_Link: https://www.snapeda.com/parts/C0603C104J4RAC/KEMET/view-part/1763758/?ref=snap; Availability: Warning; Package: 0603 KEMET; Check_prices: https://www.snapeda.com/parts/C0603C104J4RAC/KEMET/view-part/1763758/?ref=eda; Value: *; Price: None
D1G = CMP-2000-05358-1: RailClamp(R) Low Capacitance TVS Diode Array, 5 pF, 17.5 VC, -55 to 125 degC, 6-Pin SOT23, RoHS, Tape and Reel; Manufacturer: Semtech; Leakage Current (Max): 5uA; Polarity: Uni-Directional; Peak Pulse Power Dissipation: 300W; Clamping Voltage: 17.5V; Number of Elements: 1; Working Voltage: 5V; Test Current (It): 1mA; Configuration: Quad; Reverse Breakdown Voltage: 6V; Suppressor Type: DiodeArrays; Peak Pulse Current: 12A; Product Depth (mm): 1.6mm; Product Height (mm): 1.15mm; Clamping Voltage (Max): 12.5V; Rad Hardened: No; Product Length (mm): 2.9mm; Capacitance Value: 5pF; Mounting: SurfaceMount; Datasheet URL: https://datasheet.ciiva.com/8029/srv05-4-8029973.pdf; Datasheet Version: Jan-08; Packaging: TapeandReel; Package / Case: SOT-23; Operating Temp Range: -55Cto125C; Pin Count: 6; Direction Type: Uni-Directional; Operating Temperature Min Deg. C: -55C; Reverse Stand-off Voltage: 5V; Leakage Current: 5uA; Manufacturer URL: http://www.semtech.com/; Working Voltage (Max): 5V; Package Reference: SOT23-6; Package Description: 6-Pin Small Outline Transistor, Body 2.9 x 1.6 mm, Pitch 0.95 mm; Operating Temperature Max Deg. C: 125C; Operating Temperature Classification: Military; Mounting Style: SurfaceMount
FB1G = CMP-0686-00646-3: BLM21BB121SN1D; Shielding: Unshielded; Number of Circuits: 1; DC Resistance-Max: 250mR; Material: Ferrite; Tolerance: 25%; DC Resistance (DCR): 190mR; Max Current Rating: 600mA; Impedance: 120R; Max DC Current: 200mA; Case Code (Imperial): 0805; RoHS Compliant: Yes; Frequency: 100MHz; Lead Free: Lead Free; Max Operating Temperature: 125°C; Min Operating Temperature: -55°C; Length: 2mm; Packaging: Tape and Reel; Case Code (Metric): 2012; Package Quantity: 1; Depth: 1.45mm; Test Frequency: 100MHz; Width: 1.25mm; Contact Plating: Tin; Height: 0.85mm; Number of Pins: 2; Case/Package: 0805; Termination: SMD/SMT; REACH SVHC: No SVHC; Current Rating: 600mA; Weight: 0.000194oz; Core Material: Ferrite; Series: BLM21B; Number of Lines: 1
J1G = USB4510-03-1-A: USB Connector Type C SMT Mid-Mount 16 Pin; Manufacturer: GCT; Manufacturer Part Number: USB4510-03-1-A
Q1G Q2G = CMP-20235-000001-1: NPN TRANSISTOR 1.5A 40V SOT-23 R; Transition Frequency: 100MHz; Max Breakdown Voltage: 25V; Collector Emitter Voltage (VCEO): 400mV; Max Power Dissipation: 300mW; Max Collector Current: 1.5A; Case/Package: TO-236-3; Packaging: Tape and Reel; RoHS Compliant: Yes; Mount: Surface Mount; Collector Emitter Breakdown Voltage: 25V
R1G R2G R3G R4G R5G R6G = R-0603: as R1A on sheet 1_Power; Package: 0603; Price: None; Resistance: 10K; Check_prices: https://www.snapeda.com/parts/2-1623703-0/TE%20Connectivity/view-part/2213192/?ref=eda; SnapEDA_Link: https://www.snapeda.com/parts/2-1623703-0/TE%20Connectivity/view-part/2213192/?ref=snap; Availability: Warning
Y1G = ABM10-167-12.000MHZ-T3: CRYSTAL 12.00MHZ 8PF LOW ESR SMD; Manufacturer: Abracon LLC; ESR (Equivalent Series Resistance): 125 Ohms; Frequency Stability: ±30ppm; Frequency Tolerance: ±10ppm; Operating Mode: Fundamental; Part Number: ABM10-167-12.000MHZ-T3; ComponentLink1Description: Datasheet; ComponentLink1URL: https://abracon.com/Resonators/ABM10-167-12.000MHz.pdf; ComponentLink2Description: DigiKey Link; ComponentLink2URL: http://digikey.com/product-detail/en/abracon-llc/ABM10-167-12.000MHZ-T3/535-13521-1-ND/6140274; Device Package: 4-SMD, No Lead; Frequency: 12MHz; Height - Seated (Max): 0.028" (0.70mm); LastUpdated: 19-03-2020 10:27:46 PM; Lifecycle Status: Active; Load Capacitance: 8pF; Minimum Order: 1; Mounting Type: Surface Mount; Operating Temperature: -40°C ~ 85°C; Package / Case: 4-SMD, No Lead; Packaging: TapeAndReel; PartId: 284; Part Status: Active; Price: 0.28; Series: ABM10; Size / Dimension: 0.098" L x 0.079" W (2.50mm x 2.00mm); Supplier 1: DigiKey; Supplier Part Number 1: 535-13521-1-ND; Type: MHz Crystal; Value: 12MHz
U1G = CH340G: Value: *; MP: CH340G; Package: None; Availability: Unavailable; Price: None

## Sheet 6_ESP12_F.SchDoc
size A4; SheetNumber: 9; SheetTotal: 12
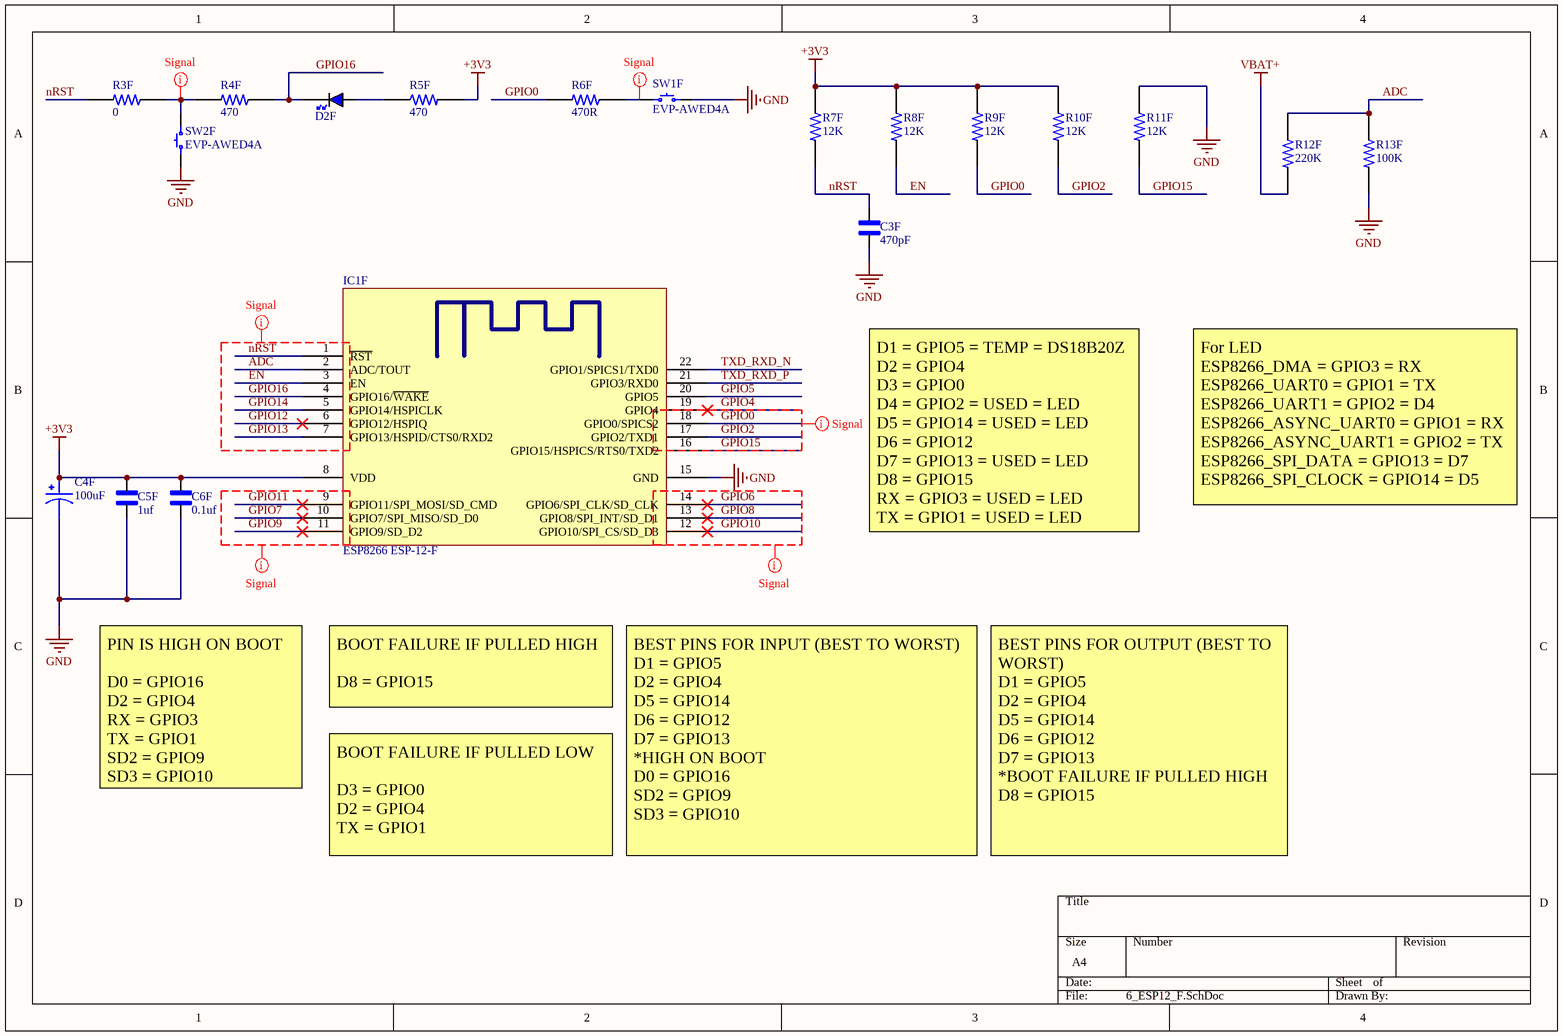
[diagram p7: 6_ESP12_F.SchDoc]

### Parts
C3F  470pF  [C-0603]
C4F  100uF  [1411-3528]
C5F  1uf  [C-0603]
C6F  0.1uf  [C-0603]
D2F  BLUE  [LED_0603_BLUE]  (value not drawn)
IC1F  ESP8266 ESP-12-F  [ESP8266 ESP-12-F]
R3F  0  [R-0603]
R4F  470  [R-0603]
R5F  470  [R-0603]
R6F  470R  [R-0603]
R7F  12K  [R-0603]
R8F  12K  [R-0603]
R9F  12K  [R-0603]
R10F  12K  [R-0603]
R11F  12K  [R-0603]
R12F  220K  [R-0603]
R13F  100K  [R-0603]
SW1F  EVP-AWED4A  [PANASONIC EVPAW]
SW2F  EVP-AWED4A  [PANASONIC EVPAW]

### Nets
+3V3: C4F.1 C5F.2 C6F.2 IC1F.8(VDD) R5F.2 R7F.1 R8F.1 R9F.1 R10F.1
GND: C3F.1 C4F.2 C5F.1 C6F.1 IC1F.15(GND) R11F.1 R13F.2 SW1F.2 SW2F.1
VBAT+: R12F.2
ADC: IC1F.2(ADC/TOUT) R12F.1 R13F.1
EN: IC1F.3(EN) R8F.2
GPIO0: IC1F.18(GPIO0/SPICS2) R6F.2 R9F.2
GPIO2: IC1F.17(GPIO2/TXD1) R10F.2
GPIO4: IC1F.19(GPIO4)
GPIO5: IC1F.20(GPIO5)
GPIO6: IC1F.14(GPIO6/SPI_CLK/SD_CLK)
GPIO7: IC1F.10(GPIO7/SPI_MISO/SD_D0)
GPIO8: IC1F.13(GPIO8/SPI_INT/SD_D1)
GPIO9: IC1F.11(GPIO9/SD_D2)
GPIO10: IC1F.12(GPIO10/SPI_CS/SD_D3)
GPIO11: IC1F.9(GPIO11/SPI_MOSI/SD_CMD)
GPIO12: IC1F.6(GPIO12/HSPIQ)
GPIO13: IC1F.7(GPIO13/HSPID/CTS0/RXD2)
GPIO14: IC1F.5(GPIO14/HSPICLK)
GPIO15: IC1F.16(GPIO15/HSPICS/RTS0/TXD2) R11F.2
GPIO16: D2F.K IC1F.4(GPIO16/~{WAKE}) R4F.1
nRST: C3F.2 IC1F.1(~{RST}) R3F.2 R7F.2
TXD_RXD_N: IC1F.22(GPIO1/SPICS1/TXD0)
TXD_RXD_P: IC1F.21(GPIO3/RXD0)
NetD2F_A: D2F.A R5F.1
NetR3F_1: R3F.1 R4F.2 SW2F.2
NetR6F_1: R6F.1 SW1F.1

### Layout directives
net class Signal: ADC, EN, GPIO0, GPIO6, GPIO7, GPIO8, GPIO9, GPIO10, GPIO11, GPIO12, GPIO13, GPIO14, GPIO16, NetR3F_1, NetR6F_1, nRST

### Notes on the sheet
- For LED
  ESP8266_DMA = GPIO3 = RX
  ESP8266_UART0 = GPIO1 = TX
  ESP8266_UART1 = GPIO2 = D4
  ESP8266_ASYNC_UART0 = GPIO1 = RX
  ESP8266_ASYNC_UART1 = GPIO2 = TX
  ESP8266_SPI_DATA = GPIO13 = D7
  ESP8266_SPI_CLOCK = GPIO14 = D5
- D1 = GPIO5 = TEMP = DS18B20Z
  D2 = GPIO4
  D3 = GPIO0
  D4 = GPIO2 = USED = LED
  D5 = GPIO14 = USED = LED
  D6 = GPIO12
  D7 = GPIO13 = USED = LED
  D8 = GPIO15
  RX = GPIO3 = USED = LED
  TX = GPIO1 = USED = LED
- BOOT FAILURE IF PULLED HIGH
  D8 = GPIO15
- PIN IS HIGH ON BOOT
  D0 = GPIO16
  D2 = GPIO4
  RX = GPIO3
  TX = GPIO1
  SD2 = GPIO9
  SD3 = GPIO10
- BOOT FAILURE IF PULLED LOW
  D3 = GPIO0
  D2 = GPIO4
  TX = GPIO1
- BEST PINS FOR INPUT (BEST TO WORST)
  D1 = GPIO5
  D2 = GPIO4
  D5 = GPIO14
  D6 = GPIO12
  D7 = GPIO13
  *HIGH ON BOOT
  D0 = GPIO16
  SD2 = GPIO9
  SD3 = GPIO10
- BEST PINS FOR OUTPUT (BEST TO WORST)
  D1 = GPIO5
  D2 = GPIO4
  D5 = GPIO14
  D6 = GPIO12
  D7 = GPIO13
  *BOOT FAILURE IF PULLED HIGH
  D8 = GPIO15

### Library data of the parts
C3F C5F C6F = C-0603: as C2A on sheet 1_Power; SnapEDA_Link: https://www.snapeda.com/parts/C0603C104J4RAC/KEMET/view-part/1763758/?ref=snap; Availability: Warning; Package: 0603 KEMET; Check_prices: https://www.snapeda.com/parts/C0603C104J4RAC/KEMET/view-part/1763758/?ref=eda; Value: *; Price: None
C4F = C-1411 (3528 Metric): Molded Tantalum Capacitors 16V 1411 (3528 Metric); MF: KEMET; MP: T495B106K025ATE750; Package: 1411 KEMET; Value: *; Availability: Unavailable; SnapEDA_Link: https://www.snapeda.com/parts/T495B106K025ATE750/KEMET/view-part/1680496/?ref=snap; Price: None
D2F = LED_0603_BLUE: LED 0603 BLUE SMD
R3F R4F R5F R6F R7F R8F R9F R10F R11F R12F R13F = R-0603: as R1A on sheet 1_Power; Package: 0603; Price: None; Resistance: 10K; Check_prices: https://www.snapeda.com/parts/2-1623703-0/TE%20Connectivity/view-part/2213192/?ref=eda; SnapEDA_Link: https://www.snapeda.com/parts/2-1623703-0/TE%20Connectivity/view-part/2213192/?ref=snap; Availability: Warning
SW1F SW2F = EVP-AWED4A: 3.0MM X 2.0MM / 3.3N / 0.15MM ST; Manufacturer: Panasonic Electronic Components; Actuator Height off PCB, Vertical: 0.60mm; Actuator Orientation: Top Actuated; Actuator Type: Standard; Circuit: SPST-NO; Contact Rating @ Voltage: 0.02A @ 15VDC; Illumination: Non-Illuminated; Ingress Protection: IP67 - Dust Tight, Waterproof; Operating Force: 330gf; Outline: 3.00mm x 2.00mm; Switch Function: Off-Mom; Part Number: EVP-AWED4A; ComponentLink1Description: Datasheet; ComponentLink1URL: https://industrial.panasonic.com/ac/cdn/e/control/switch/light-touch/catalog/sw_lt_eng_3020s.pdf; ComponentLink2Description: DigiKey Link; ComponentLink2URL: https://www.digikey.com/en/products/detail/panasonic-electronic-components/EVP-AWED4A/8568275; LastUpdated: 29-12-2022 09:10:40 PM; Lifecycle Status: Active; Minimum Order: 1; Mounting Type: Surface Mount; Operating Temperature: -40°C ~ 85°C; Packaging: TapeAndReel; Part Status: Active; Price: 0.16; Series: EVPAW; Supplier 1: DigiKey; Supplier Part Number 1: P123440CT-ND; Termination Style: SMD (SMT) Tab

## Sheet 7_Temp.SchDoc
size A4; SheetNumber: 10; SheetTotal: 12
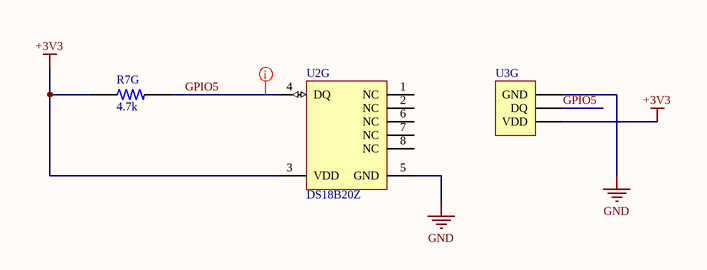
[diagram p8: 7_Temp.SchDoc]

### Parts
R7G  4.7k  [R-0603]
U2G  DS18B20Z  [MAXM-S8-2_N]
U3G  Header 3  [HDR1X3]  (value not drawn)

### Nets
+3V3: R7G.1 U2G.3(VDD) U3G.3(VDD)
GND: U2G.5(GND) U3G.1(GND)
GPIO5: R7G.2 U2G.4(DQ) U3G.2(DQ)

Not connected (* = marked no-connect by the designer): U2G 1(NC) 2(NC) 6(NC) 7(NC) 8(NC)

### Layout directives
net class Signal_50ohm: GPIO5

### Library data of the parts
R7G = R-0603: as R1A on sheet 1_Power; Package: 0603; Price: None; Resistance: 10K; Check_prices: https://www.snapeda.com/parts/2-1623703-0/TE%20Connectivity/view-part/2213192/?ref=eda; SnapEDA_Link: https://www.snapeda.com/parts/2-1623703-0/TE%20Connectivity/view-part/2213192/?ref=snap; Availability: Warning
U2G = CMP-0253-00023-2: High-Precision 1-Wire Digital Thermometer, -55 to 125 degC, 8-Pin SOIC (S8-2); Parasite Pwr.: Yes; Temp. Thresh.: Programmable (NV); Sensor Type: Local; Code_JEDEC: MS012; Mounting Technology: Surface Mount; ComponentLink3Description: Package Specification; PartNumber: DS18B20Z; ComponentLink2Description: Datasheet; ComponentLink3URL: http://pdfserv.maximintegrated.com/package_dwgs/21-0041.PDF; PackageVersion: Rev. D, 10/2012; ComponentLink1URL: http://www.maximintegrated.com/; Multi Droppable: Yes; ComponentLink1Description: Manufacturer URL; ComponentLink2URL: http://datasheets.maximintegrated.com/en/ds/DS18B20.pdf; Generic Part Number: DS18B20; PackageReference: S8-2; PackageDescription: 8-Pin Small-Outline IC, Narrow (0.15in) (S8-2), Body 4.90 x 3.90 mm, Pitch 1.27 mm; Interface: 1-Wire; DatasheetVersion: Rev. 4
U3G = Header 3: Header, 3-Pin; LatestRevisionDate: 17-Jul-2002; LatestRevisionNote: Re-released for DXP Platform.; Publisher: Altium Limited

## Sheet 8_LevelShifter.SchDoc
size A4; SheetNumber: 11; SheetTotal: 12
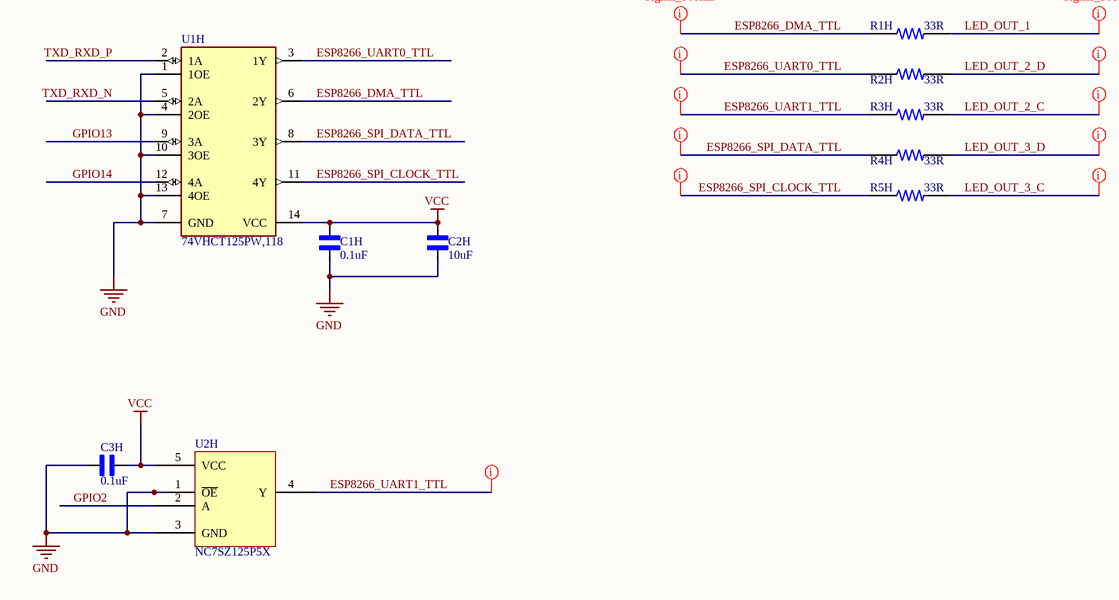
[diagram p9: 8_LevelShifter.SchDoc]

### Parts
C1H  0.1uF  [C-0603]
C2H  10uF  [C-0603]
C3H  0.1uF  [C-0603]
R1H  33R  [R-0603]
R2H  33R  [R-0603]
R3H  33R  [R-0603]
R4H  33R  [R-0603]
R5H  33R  [R-0603]
U1H  74VHCT125PW,118  [SOP65P640X110-14N]
U2H  NC7SZ125P5X  [ON SEMI SC70-5  419AC-01]

### Nets
GND: C1H.1 C2H.1 C3H.1 U1H.1(1OE) U1H.4(2OE) U1H.7(GND) U1H.10(3OE) U1H.13(4OE) U2H.1(~{OE}) U2H.3(GND)
VCC: C1H.2 C2H.2 C3H.2 U1H.14(VCC) U2H.5(VCC)
ESP8266_DMA_TTL: R1H.1 U1H.6(2Y)
ESP8266_SPI_CLOCK_TTL: R5H.1 U1H.11(4Y)
ESP8266_SPI_DATA_TTL: R4H.1 U1H.8(3Y)
ESP8266_UART0_TTL: R2H.1 U1H.3(1Y)
ESP8266_UART1_TTL: R3H.1 U2H.4(Y)
GPIO2: U2H.2(A)
GPIO13: U1H.9(3A)
GPIO14: U1H.12(4A)
LED_OUT_1: R1H.2
LED_OUT_2_C: R3H.2
LED_OUT_2_D: R2H.2
LED_OUT_3_C: R5H.2
LED_OUT_3_D: R4H.2
TXD_RXD_N: U1H.5(2A)
TXD_RXD_P: U1H.2(1A)

### Layout directives
net class Signal_50ohm: ESP8266_DMA_TTL, ESP8266_SPI_CLOCK_TTL, ESP8266_SPI_DATA_TTL, ESP8266_UART0_TTL, ESP8266_UART1_TTL, LED_OUT_1, LED_OUT_2_C, LED_OUT_2_D, LED_OUT_3_C, LED_OUT_3_D

### Library data of the parts
C1H C2H C3H = C-0603: as C2A on sheet 1_Power; SnapEDA_Link: https://www.snapeda.com/parts/C0603C104J4RAC/KEMET/view-part/1763758/?ref=snap; Availability: Warning; Package: 0603 KEMET; Check_prices: https://www.snapeda.com/parts/C0603C104J4RAC/KEMET/view-part/1763758/?ref=eda; Value: *; Price: None
R1H R2H R3H R4H R5H = R-0603: as R1A on sheet 1_Power; Package: 0603; Price: None; Resistance: 10K; Check_prices: https://www.snapeda.com/parts/2-1623703-0/TE%20Connectivity/view-part/2213192/?ref=eda; SnapEDA_Link: https://www.snapeda.com/parts/2-1623703-0/TE%20Connectivity/view-part/2213192/?ref=snap; Availability: Warning
U1H = 74VHCT125PW,118: Buffer, Non-Inverting 4 Element 1 Bit per Element 3-State Output 14-SOIC; MP: 74HC125; MF: Nexperia USA; Value: *; SnapEDA_Link: https://www.snapeda.com/parts/74HC125/Nexperia%20USA%20Inc./view-part/560724/?ref=snap; Availability: Unavailable; Price: None; Package: SOIC-14 STMicroelectronics
U2H = NC7SZ125P5X: IC BUF NON-INVERT 5.5V SC70-5; Manufacturer: ON Semiconductor; Current - Output High, Low: 32mA, 32mA; Logic Type: Buffer, Non-Inverting; Number of Bits per Element: 1; Output Type: 3-State; Voltage - Supply: 1.65V ~ 5.5V; Part Number: NC7SZ125P5X; ComponentLink1Description: Datasheet; ComponentLink1URL: https://www.onsemi.com/pub/Collateral/NC7SZ125-D.PDF; ComponentLink2Description: DigiKey Link; ComponentLink2URL: //digikey.com/product-detail/en/on-semiconductor/NC7SZ125P5X/NC7SZ125P5XTR-ND/673366; Device Package: 5-TSSOP, SC-70-5, SOT-353; LastUpdated: 09-12-2019 01:20:32 AM; Lifecycle Status: 0; Minimum Order: 1; Mounting Type: Surface Mount; Number of Elements: 1; Operating Temperature: -40°C ~ 85°C (TA); Package / Case: 5-TSSOP, SC-70-5, SOT-353; Packaging: TapeAndReel; PartId: 2; Part Status: Active; Price: 0.07; Series: 7SZ; Supplier 1: DigiKey; Supplier Part Number 1: NC7SZ125P5XTR-ND; Supplier Device Package: SC-70-5

## Sheet 9_Connectors & IO.SchDoc
size A4; SheetNumber: 12; SheetTotal: 12
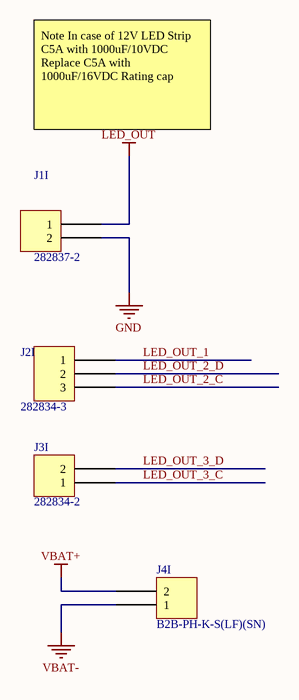
[diagram p10: 9_Connectors & IO.SchDoc]

### Parts
J1I  282837-2  [TE 282837-2]
J2I  282834-3  [TE 282834-3]
J3I  282834-2  [TE 282834-2]
J4I  B2B-PH-K-S(LF)(SN)  [JST B2B-PH-K]

### Nets
GND: J1I.2
LED_OUT: J1I.1
VBAT+: J4I.2
VBAT-: J4I.1
LED_OUT_1: J2I.1
LED_OUT_2_C: J2I.3
LED_OUT_2_D: J2I.2
LED_OUT_3_C: J3I.1
LED_OUT_3_D: J3I.2

### Notes on the sheet
- Note In case of 12V LED Strip
  C5A with 1000uF/10VDC
  Replace C5A with 1000uF/16VDC Rating cap

### Library data of the parts
J1I = 282837-2: as J1A on sheet 1_Power; Packaging: Tray; Part Number: 282837-2; Color: Green; ComponentLink1Description: Datasheet; ComponentLink1URL: https://www.te.com/commerce/DocumentDelivery/DDEController?Action=srchrtrv&DocNm=282837&DocType=Customer+Drawing&DocLang=English; ComponentLink2Description: DigiKey Link; ComponentLink2URL: https://www.digikey.com/en/products/detail/te-connectivity-amp-connectors/282837-2/2187973; LastUpdated: 21-06-2022 03:00:23 PM; Lifecycle Status: Active; Minimum Order: 1; Mounting Type: Through Hole; Part Status: Active; Price: 0.31; Series: Buchanan; Supplier 1: DigiKey; Supplier Part Number 1: A113320-ND; Features: Interlocking (Side)
J2I = 282834-3: TERM BLK 3P SIDE ENT 2.54MM PCB; Manufacturer: TE Connectivity AMP Connectors; Current: 10A; Mating Orientation: Horizontal with Board; Number of Levels: 1; Pitch: 0.100" (2.54mm); Positions Per Level: 3; Voltage: 150V; Wire Gauge: 16-30 AWG; Wire Termination: Screw - Rising Cage Clamp; Part Number: 282834-3; ComponentLink1Description: Datasheet; ComponentLink1URL: https://www.te.com/commerce/DocumentDelivery/DDEController?Action=srchrtrv&DocNm=282834&DocType=Customer+Drawing&DocLang=English; ComponentLink2Description: DigiKey Link; ComponentLink2URL: http://digikey.com/product-detail/en/te-connectivity-amp-connectors/282834-3/A98334-ND/1153264; LastUpdated: 15-01-2020 04:15:50 AM; Lifecycle Status: Active; Minimum Order: 1; Mounting Type: Through Hole; Packaging: Bulk; Part Status: Active; Price: 2.01; Series: Buchanan; Supplier 1: DigiKey; Supplier Part Number 1: A98334-ND; Color: Green
J3I = 282834-2: TERM BLK 2P SIDE ENT 2.54MM PCB; Manufacturer: TE Connectivity AMP Connectors; Current: 10A; Mating Orientation: Horizontal with Board; Number of Levels: 1; Pitch: 0.100" (2.54mm); Positions Per Level: 2; Voltage: 150V; Wire Gauge: 16-30 AWG; Wire Termination: Screw - Rising Cage Clamp; Part Number: 282834-2; ComponentLink1Description: Datasheet; ComponentLink1URL: https://www.te.com/commerce/DocumentDelivery/DDEController?Action=srchrtrv&DocNm=282834&DocType=Customer+Drawing&DocLang=English; ComponentLink2Description: DigiKey Link; ComponentLink2URL: http://digikey.com/product-detail/en/te-connectivity-amp-connectors/282834-2/A98333-ND/1150135; LastUpdated: 15-01-2020 04:15:38 AM; Lifecycle Status: Active; Minimum Order: 1; Mounting Type: Through Hole; Packaging: Bulk; Part Status: Active; Price: 0.88; Series: Buchanan; Supplier 1: DigiKey; Supplier Part Number 1: A98333-ND; Color: Green
J4I = B2B-PH-K-S(LF)(SN): CONN HEADER VERT 2POS 2MM; Manufacturer: JST Sales America Inc.; Contact Length - Mating: 0.130" (3.30mm); Contact Length - Post: 0.134" (3.40mm); Current Rating (Amps): 2A; Material Flammability Rating: UL94 V-0; Number of Positions: 2; Number of Positions Loaded: All; Overall Contact Length: 0.333" (8.45mm); Pitch - Mating: 0.079" (2.00mm); Shrouding: Shrouded - 4 Wall; Style: Board to Cable/Wire; Voltage Rating: 100V; Part Number: B2B-PH-K-S(LF)(SN); ComponentLink1Description: Datasheet; ComponentLink1URL: http://www.jst-mfg.com/product/pdf/eng/ePH.pdf; ComponentLink2Description: DigiKey Link; ComponentLink2URL: http://digikey.com/product-detail/en/jst-sales-america-inc/B2B-PH-K-S-LF-SN/455-1704-ND/926611; Connector Type: Header; Contact Finish - Mating: Tin; Contact Finish - Post: Tin; Contact Material: Brass; Contact Shape: Square; Contact Type: Male Pin; Fastening Type: Detent Lock; Insulation Color: Natural; Insulation Height: 0.236" (6.00mm); Insulation Material: Polyamide (PA66), Nylon 6/6; LastUpdated: 03-01-2020 11:40:58 PM; Lifecycle Status: Active; Minimum Order: 1; Mounting Type: Through Hole; Number of Rows: 1; Operating Temperature: -25°C ~ 85°C; Packaging: Bulk; PartId: 11; Part Status: Active; Price: 0.17; Series: PH; Supplier 1: DigiKey; Supplier Part Number 1: 455-1704-ND; Termination: Press-Fit, Solder

## Nets that join several sheets
+3V3: 5_BATT+3V3 (F1E.2), 6_ESP12_F (9 pins), 7_Temp (R7G.1 U2G.3 U3G.3)
GND: 1_Power (10 pins), 2_LDO+5V (C1B.1 C2B.1 C3B.1 R2B.2), 3_Charging (R3C.1 U1C.1 U1C.3), 4_Protection (Q1D.2 Q1D.3 R1D.1), 5_BATT+3V3 (8 pins), 6_BATT+5V (5 pins), 5_USB-UART (16 pins), 6_ESP12_F (9 pins), 7_Temp (U2G.5 U3G.1), 8_LevelShifter (10 pins), 9_Connectors & IO (J1I.2)
LDO+5V: 1_Power (D4A.1), 2_LDO+5V (C2B.2 R1B.2 U1B.2 U1B.4)
LDO-IN+5V: 1_Power (JP2A.2), 2_LDO+5V (C1B.2 U1B.3)
LED_OUT: 1_Power (F2A.2), 9_Connectors & IO (J1I.1)
VBAT+: 3_Charging (U1C.5), 4_Protection (R2D.2), 5_BATT+3V3 (JP1E.1), 6_BATT+5V (C2F.2 L1F.1 U1F.4 U1F.5), 6_ESP12_F (R12F.2), 9_Connectors & IO (J4I.2)
VBAT-: 4_Protection (C1D.1 Q1D.6 Q1D.7 U1D.6), 9_Connectors & IO (J4I.1)
VBUS: 1_Power (D2A.1), 5_USB-UART (6 pins)
VCC: 1_Power (F1A.2), 3_Charging (JP1C.1), 5_BATT+3V3 (JP1E.3), 8_LevelShifter (5 pins)
GPIO0: 5_USB-UART (Q2G.3), 6_ESP12_F (IC1F.18 R6F.2 R9F.2)
GPIO2: 6_ESP12_F (IC1F.17 R10F.2), 8_LevelShifter (U2H.2)
GPIO5: 6_ESP12_F (IC1F.20), 7_Temp (R7G.2 U2G.4 U3G.2)
GPIO13: 6_ESP12_F (IC1F.7), 8_LevelShifter (U1H.9)
GPIO14: 6_ESP12_F (IC1F.5), 8_LevelShifter (U1H.12)
LED_OUT_1: 8_LevelShifter (R1H.2), 9_Connectors & IO (J2I.1)
LED_OUT_2_C: 8_LevelShifter (R3H.2), 9_Connectors & IO (J2I.3)
LED_OUT_2_D: 8_LevelShifter (R2H.2), 9_Connectors & IO (J2I.2)
LED_OUT_3_C: 8_LevelShifter (R5H.2), 9_Connectors & IO (J3I.1)
LED_OUT_3_D: 8_LevelShifter (R4H.2), 9_Connectors & IO (J3I.2)
nRST: 5_USB-UART (Q1G.3), 6_ESP12_F (C3F.2 IC1F.1 R3F.2 R7F.2)
TXD_RXD_N: 5_USB-UART (R3G.2), 6_ESP12_F (IC1F.22), 8_LevelShifter (U1H.5)
TXD_RXD_P: 5_USB-UART (R4G.2), 6_ESP12_F (IC1F.21), 8_LevelShifter (U1H.2)